# Altium schematic sheet SCH6_Main_computer_Display.SchDoc: Main Computer - Display
size B; Organization: CWRUbotix; Address1: 10900 Euclid Avenue; Address2: Cleveland, OH 44106; Address3: USA; Revision: 1.0; SheetNumber: 6; SheetTotal: 13
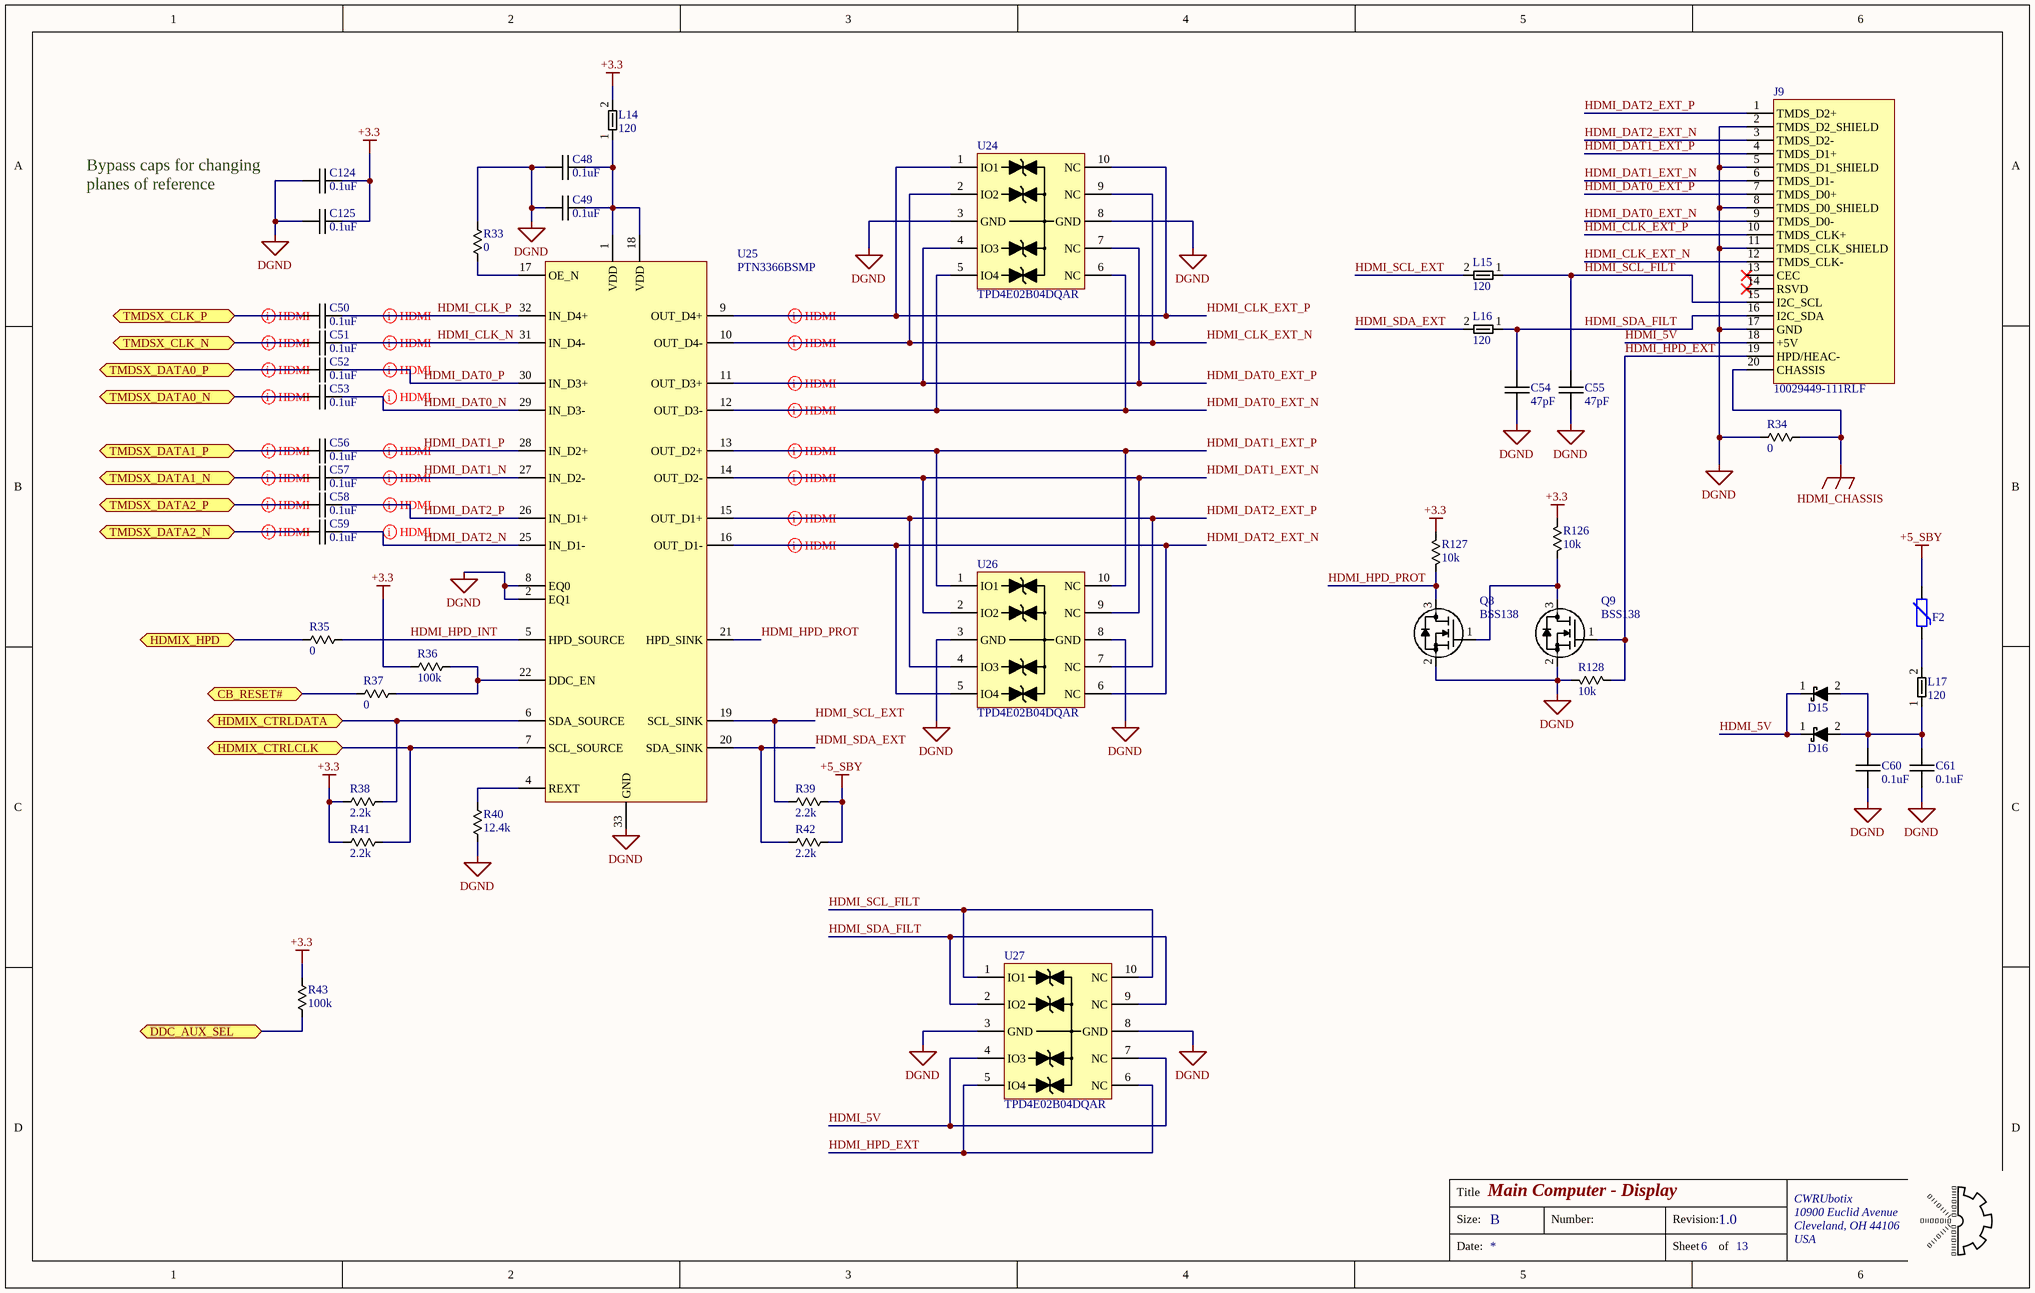
[diagram p0: SCH6_Main_computer_Display.SchDoc]

## Parts
C48  0.1uF  [chip_0603]
C49  0.1uF  [chip_0603]
C50  0.1uF  [chip_0603]
C51  0.1uF  [chip_0603]
C52  0.1uF  [chip_0603]
C53  0.1uF  [chip_0603]
C54  47pF  [chip_0603]
C55  47pF  [chip_0603]
C56  0.1uF  [chip_0603]
C57  0.1uF  [chip_0603]
C58  0.1uF  [chip_0603]
C59  0.1uF  [chip_0603]
C60  0.1uF  [chip_0603]
C61  0.1uF  [chip_0603]
C124  0.1uF  [chip_0603]
C125  0.1uF  [chip_0603]
D15  diode_2  [sod123_0]  (value not drawn)
D16  diode_2  [sod123_0]  (value not drawn)
F2  PTC_0  [chip_1210]  (value not drawn)
J9  10029449-111RLF  [AMPHENOL_10029449]
L14  Impedance: 120  [CHIP_0603_FE]  (hidden comment: bead_0)
L15  Impedance: 120  [CHIP_0603_FE]  (hidden comment: bead_0)
L16  Impedance: 120  [CHIP_0603_FE]  (hidden comment: bead_0)
L17  Impedance: 120  [CHIP_0603_FE]  (hidden comment: bead_0)
Q8  Manufacturer PN: BSS138  [sot-23-3]  (hidden comment: n-mosfet_1)
Q9  Manufacturer PN: BSS138  [sot-23-3]  (hidden comment: n-mosfet_1)
R33  0  [chip_0805]
R34  0  [chip_0805]
R35  0  [chip_0805]
R36  100k  [chip_0603]
R37  0  [chip_0805]
R38  2.2k  [chip_0603]
R39  2.2k  [chip_0603]
R40  12.4k  [chip_0603]
R41  2.2k  [chip_0603]
R42  2.2k  [chip_0603]
R43  100k  [chip_0603]
R126  10k  [chip_0603]
R127  10k  [chip_0603]
R128  10k  [chip_0603]
U24  TPD4E02B04DQAR  [USON-10]
U25  PTN3366BSMP  [HVQFN-32]
U26  TPD4E02B04DQAR  [USON-10]
U27  TPD4E02B04DQAR  [USON-10]

## Ports
CB_RESET# (bidir), DDC_AUX_SEL (bidir), HDMIX_CTRLCLK (bidir), HDMIX_CTRLDATA (bidir), HDMIX_HPD (bidir), TMDSX_CLK_N (bidir), TMDSX_CLK_P (bidir), TMDSX_DATA0_N (bidir), TMDSX_DATA0_P (bidir), TMDSX_DATA1_N (bidir), TMDSX_DATA1_P (bidir), TMDSX_DATA2_N (bidir), TMDSX_DATA2_P (bidir)

## Nets
+3.3: C124.2 C125.2 L14.2 R36.1 R38.1 R41.1 R43.2 R126.1 R127.1
+5_SBY: F2.2 R39.2 R42.2
DGND: C48.1 C49.1 C54.2 C55.2 C60.1 C61.1 C124.1 C125.1 J9.2(TMDS_D2_SHIELD) J9.5(TMDS_D1_SHIELD) J9.8(TMDS_D0_SHIELD) J9.11(TMDS_CLK_SHIELD) J9.17(GND) Q8.2(S) Q9.2(S) R33.2 R34.2 R40.2 R128.2 U24.3(GND) U24.8(GND) U25.2(EQ1) U25.8(EQ0) U25.33(GND) U26.3(GND) U26.8(GND) U27.3(GND) U27.8(GND)
HDMI_CHASSIS: J9.20(CHASSIS) R34.1
CB_RESET#: R37.1 ; port CB_RESET#
DDC_AUX_SEL: R43.1 ; port DDC_AUX_SEL
HDMI_5V: D15.1 D16.1 J9.18(+5V) U27.4(IO3) U27.7(NC)
HDMI_CLK_EXT_N: J9.12(TMDS_CLK-) U24.2(IO2) U24.9(NC) U25.10(OUT_D4-)
HDMI_CLK_EXT_P: J9.10(TMDS_CLK+) U24.1(IO1) U24.10(NC) U25.9(OUT_D4+)
HDMI_CLK_N: C51.2 U25.31(IN_D4-)
HDMI_CLK_P: C50.2 U25.32(IN_D4+)
HDMI_DAT0_EXT_N: J9.9(TMDS_D0-) U24.5(IO4) U24.6(NC) U25.12(OUT_D3-)
HDMI_DAT0_EXT_P: J9.7(TMDS_D0+) U24.4(IO3) U24.7(NC) U25.11(OUT_D3+)
HDMI_DAT0_N: C53.2 U25.29(IN_D3-)
HDMI_DAT0_P: C52.2 U25.30(IN_D3+)
HDMI_DAT1_EXT_N: J9.6(TMDS_D1-) U25.14(OUT_D2-) U26.2(IO2) U26.9(NC)
HDMI_DAT1_EXT_P: J9.4(TMDS_D1+) U25.13(OUT_D2+) U26.1(IO1) U26.10(NC)
HDMI_DAT1_N: C57.2 U25.27(IN_D2-)
HDMI_DAT1_P: C56.2 U25.28(IN_D2+)
HDMI_DAT2_EXT_N: J9.3(TMDS_D2-) U25.16(OUT_D1-) U26.5(IO4) U26.6(NC)
HDMI_DAT2_EXT_P: J9.1(TMDS_D2+) U25.15(OUT_D1+) U26.4(IO3) U26.7(NC)
HDMI_DAT2_N: C59.2 U25.25(IN_D1-)
HDMI_DAT2_P: C58.2 U25.26(IN_D1+)
HDMI_HPD_EXT: J9.19(HPD/HEAC-) Q9.1(G) R128.1 U27.5(IO4) U27.6(NC)
HDMI_HPD_INT: R35.1 U25.5(HPD_SOURCE)
HDMI_HPD_PROT: Q8.3(D) R127.2 U25.21(HPD_SINK)
HDMI_SCL_EXT: L15.2 R39.1 U25.19(SCL_SINK)
HDMI_SCL_FILT: C55.1 J9.15(I2C_SCL) L15.1 U27.1(IO1) U27.10(NC)
HDMI_SDA_EXT: L16.2 R42.1 U25.20(SDA_SINK)
HDMI_SDA_FILT: C54.1 J9.16(I2C_SDA) L16.1 U27.2(IO2) U27.9(NC)
HDMIX_CTRLCLK: R41.2 U25.7(SCL_SOURCE) ; port HDMIX_CTRLCLK
HDMIX_CTRLDATA: R38.2 U25.6(SDA_SOURCE) ; port HDMIX_CTRLDATA
HDMIX_HPD: R35.2 ; port HDMIX_HPD
TMDSX_CLK_N: C51.1 ; port TMDSX_CLK_N
TMDSX_CLK_P: C50.1 ; port TMDSX_CLK_P
TMDSX_DATA0_N: C53.1 ; port TMDSX_DATA0_N
TMDSX_DATA0_P: C52.1 ; port TMDSX_DATA0_P
TMDSX_DATA1_N: C57.1 ; port TMDSX_DATA1_N
TMDSX_DATA1_P: C56.1 ; port TMDSX_DATA1_P
TMDSX_DATA2_N: C59.1 ; port TMDSX_DATA2_N
TMDSX_DATA2_P: C58.1 ; port TMDSX_DATA2_P
NetC48_2: C48.2 C49.2 L14.1 U25.1(VDD) U25.18(VDD)
NetC60_2: C60.2 C61.2 D15.2 D16.2 L17.1
NetF2_1: F2.1 L17.2
NetQ8_1: Q8.1(G) Q9.3(D) R126.2
NetR33_1: R33.1 U25.17(OE_N)
NetR36_2: R36.2 R37.2 U25.22(DDC_EN)
NetR40_1: R40.1 U25.4(REXT)

Not connected (* = marked no-connect by the designer): J9 13(CEC)* 14(RSVD)*; U25 3(NC) 23(NC) 24(NC)

## Layout directives
differential pair: HDMI_CLK_EXT_N, HDMI_CLK_EXT_P, HDMI_CLK_N, HDMI_CLK_P, HDMI_DAT0_EXT_N, HDMI_DAT0_EXT_P, HDMI_DAT0_N, HDMI_DAT0_P, HDMI_DAT1_EXT_N, HDMI_DAT1_EXT_P, HDMI_DAT1_N, HDMI_DAT1_P, HDMI_DAT2_EXT_N, HDMI_DAT2_EXT_P, HDMI_DAT2_N, HDMI_DAT2_P, TMDSX_CLK_N, TMDSX_CLK_P, TMDSX_DATA0_N, TMDSX_DATA0_P, TMDSX_DATA1_N, TMDSX_DATA1_P, TMDSX_DATA2_N, TMDSX_DATA2_P

## Notes on the sheet
- Bypass caps for changing planes of reference
- Title
- Size:
- B
- Number:
- Revision:
- Date:
- Sheet
- of

## Library data of the parts
C48-C53 C56-C61 C124 C125 = CAP-00542: CAP, 0.1uF, ±10%, 16V, X7R, 0603; Manufacturer: Murata; Part Number: CAP-00542; Capacitance: 0.1uF; Tolerance: ±10%; Voltage Rating: 16V; Type: X7R
C54 C55 = CAP-00406: CAP, 47pF, ±2%, 50V, C0G, 0603; Manufacturer: Murata; Manufacturer PN: GRM1885C1H470GA01J; Part Number: CAP-00406; Capacitance: 47pF; Tolerance: ±2%; Voltage Rating: 50V; Type: C0G
D15 D16 = DIO-00001: Dio Shtky, 1A, 0.55V, 40V, SOD-123; Manufacturer: ON Semi; Manufacturer PN: MBR140SFT1G; Forward Voltage: 550mV; Type: Schottky; Part Number: DIO-00001; Reverse Breakdown Voltage: 40V; Current Rating: 1A
F2 = MISC-00056: PTC Fuse (Polyfuse), 16V 1.5A Hold, 3A Trip, 300ms; Manufacturer: Littelfuse; Manufacturer PN: 1210L150/16WR; Part Number: MISC-00056; Cost: 1
J9 = CONN-00080: HDMI Type A Jack, Right-Angle, SMD+Thru-Hole; Manufacturer: Amphenol; Positions per level: 19; Levels: 1; Current: 0.5; Part Number: CONN-00080; Type: Jack; Manufacturer PN: 10029449-111RLF; Cost: 0.8
L14-L17 = MAG-00126: Fe Bead, 120 @ 100MHz, 800mA, 0603; Manufacturer: Murata; Manufacturer PN: BLM18AG121SN1D; DCR: 180mOhm; Part Number: MAG-00126; Current Rating: 800mA; Test Freq: 100MHz; Cost: 0.1
Q8 Q9 = XSTR-00017: XSTR NMOS, 220mA, 50V, Vgs 1.3V, SOT-23-3; Manufacturer: ON Semi; Max Power: 360mW; Type: NFET; Part Number: XSTR-00017; Max Voltage: 50V; Max Current: 220mA; Vgs/Vce: 1.3V; Cost: 0.31
R33-R35 R37 = RES-00720: RES SMD 0 OHM 1/8W 0805 Thick Film; Manufacturer: Stackpole; Manufacturer PN: RMCF0805ZT0R00; Tolerance: Jumper; Part Number: RES-00720; Resistance: 0; Power Rating: 1/8W; Cost: 0.1
R36 R43 = RES-00301: RES SMD 100K OHM 1% 1/4W 0603; Manufacturer: Panasonic; Manufacturer PN: ERJ-PA3F1003V; Power Rating: 0.25W; Part Number: RES-00301; Resistance: 100k; Tolerance: 1%
R38 R39 R41 R42 = RES-00365: RES SMD 2.2K OHM 1% 1/4W 0603; Manufacturer: Panasonic; Manufacturer PN: ERJ-PA3F2201V; Power Rating: 0.25W; Part Number: RES-00365; Resistance: 2.2k; Tolerance: 1%
R40 = RES-00721: RES SMD 12.4K OHM 1% 1/10W 0603; Manufacturer: Stackpole; Manufacturer PN: RMCF0603FT12K4; Part Number: RES-00721; Resistance: 12.4k; Tolerance: 1%; Power Rating: 1/10W; Cost: 0.1
R126-R128 = RES-00306: RES SMD 10K OHM 1% 1/4W 0603; Manufacturer: Panasonic; Manufacturer PN: ERJ-PA3F1002V; Power Rating: 0.25W; Part Number: RES-00306; Resistance: 10k; Tolerance: 1%; Cost: 0.144
U24 U26 U27 = DIO-00068: TVS, 4-Ch, ESD Protec, 3.6V 8.8V 10-USON; Manufacturer: TI; Power Rating: 17W; Current Rating: 2A; Part Number: DIO-00068; Type: TVS; Manufacturer PN: TPD4E02B04DQAR; Cost: 0.56
U25 = IFACE-00026: IC, Video Level Shifter, HDMI v1.4b, 32-HVQFN, PTN3366; Manufacturer: NXP; Part Number: IFACE-00026; Manufacturer PN: PTN3366BSMP; Cost: 0.94